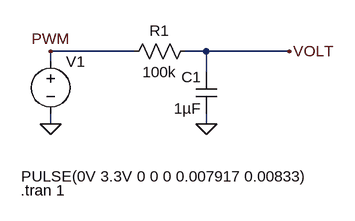
[diagram p0: schematic Digi_SXRadio_RSSIPinSim.asc]
Digi_SXRadio_RSSIPinSim.asc, the LTspice schematic file:
Version 4
SHEET 1 880 680
WIRE 48 64 -80 64
WIRE 160 64 128 64
WIRE 288 64 160 64
WIRE -80 80 -80 64
WIRE 160 96 160 64
WIRE -80 176 -80 160
WIRE 160 176 160 160
FLAG 160 176 0
FLAG -80 176 0
FLAG -80 64 PWM
FLAG 288 64 VOLT
SYMBOL cap 176 160 R180
WINDOW 0 24 56 Left 2
WINDOW 3 24 8 Left 2
SYMATTR InstName C1
SYMATTR Value 1µF
SYMBOL res 144 48 R90
WINDOW 0 0 56 VBottom 2
WINDOW 3 32 56 VTop 2
SYMATTR InstName R1
SYMATTR Value 100k
SYMBOL voltage -80 64 R0
WINDOW 3 -45 193 Left 2
WINDOW 123 0 0 Left 0
WINDOW 39 0 0 Left 0
SYMATTR InstName V1
SYMATTR Value PULSE(0V 3.3V 0 0 0 0.007917 0.00833)
TEXT -126 278 Left 2 !.tran 1

The netlist it stands for:
* Digi_SXRadio_RSSIPinSim.asc
C1 0 VOLT 1µF
R1 VOLT PWM 100k
V1 PWM 0 PULSE(0V 3.3V 0 0 0 0.007917 0.00833)
.tran 1
.backanno
.end